# Altium schematic sheet ArduinoProMiniShematic.SchDoc
size A4
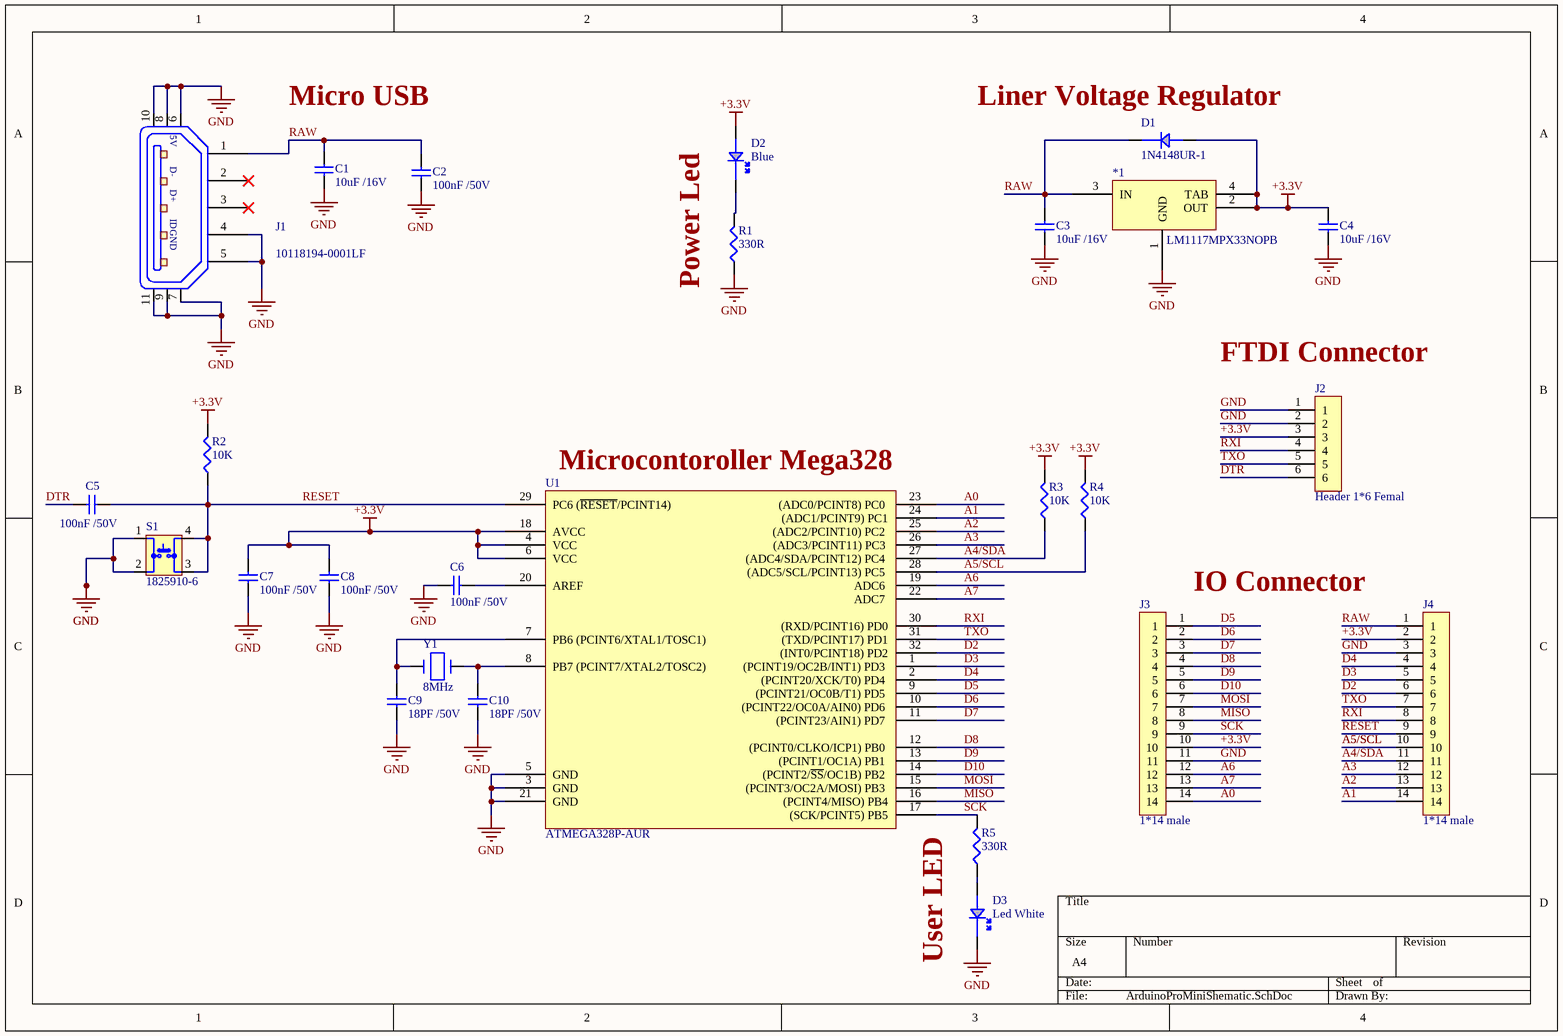
[diagram p0: ArduinoProMiniShematic.SchDoc]

## Parts
*1  LM1117MPX33NOPB  [SOT 223]
C1  10uF /16V  [C 0805]
C2  100nF /50V  [C 0805]
C3  10uF /16V  [C 0805]
C4  10uF /16V  [C 0805]
C5  100nF /50V  [C 0805]
C6  100nF /50V  [C 0805]
C7  100nF /50V  [C 0805]
C8  100nF /50V  [C 0805]
C9  18PF /50V  [C 0805]
C10  18PF /50V  [C 0805]
D1  1N4148UR-1  [DO 213AA]
D2  Blue  [LED 0603]
D3  Led White  [LED 0603]
J1  10118194-0001LF  [10118194-0001LF]
J2  Header 1*6 Femal  [Header female 1*6]
J3  1*14 male  [1*4 male header]
J4  1*14 male  [1*4 male header]
R1  330R  [R 0805]
R2  10K
R3  10K
R4  10K
R5  330R  [R 0805]
S1  1825910-6  [1825910-6]
U1  ATMEGA328P-AUR  [TQFP-32]
Y1  8MHz  [CSM-7X]

## Nets
+3.3V: *1.2(OUT) *1.4(TAB) C4.2 C7.2 C8.2 D1.1(anode) D2.1(anode) J2.3 J3.10 J4.2 R2.6 R3.6 R4.6 U1.4(VCC) U1.6(VCC) U1.18(AVCC)
GND: *1.1(GND) C1.1 C2.2 C3.1 C4.1 C6.2 C7.1 C8.1 C9.1 C10.1 D3.2(cathode) J1.4 J1.5 J1.6 J1.7 J1.8 J1.9 J1.10 J1.11 J2.1 J2.2 J3.11 J4.3 R1.5 S1.1 S1.2 U1.3(GND) U1.5(GND) U1.21(GND)
A0: J3.14 U1.23((ADC0/PCINT8)_PC0)
A1: J4.14 U1.24((ADC1/PCINT9)_PC1)
A2: J4.13 U1.25((ADC2/PCINT10)_PC2)
A3: J4.12 U1.26((ADC3/PCINT11)_PC3)
A4/SDA: J4.11 R3.5 U1.27((ADC4/SDA/PCINT12)_PC4)
A5/SCL: J4.10 R4.5 U1.28((ADC5/SCL/PCINT13)_PC5)
A6: J3.12 U1.19(ADC6)
A7: J3.13 U1.22(ADC7)
D2: J4.6 U1.32((INT0/PCINT18)_PD2)
D3: J4.5 U1.1((PCINT19/OC2B/INT1)_PD3)
D4: J4.4 U1.2((PCINT20/XCK/T0)_PD4)
D5: J3.1 U1.9((PCINT21/OC0B/T1)_PD5)
D6: J3.2 U1.10((PCINT22/OC0A/AIN0)_PD6)
D7: J3.3 U1.11((PCINT23/AIN1)_PD7)
D8: J3.4 U1.12((PCINT0/CLKO/ICP1)_PB0)
D9: J3.5 U1.13((PCINT1/OC1A)_PB1)
D10: J3.6 U1.14((PCINT2/~{SS}/OC1B)_PB2)
DTR: C5.1 J2.6
MISO: J3.8 U1.16((PCINT4/MISO)_PB4)
MOSI: J3.7 U1.15((PCINT3/OC2A/MOSI)_PB3)
RAW: *1.3(IN) C1.2 C2.1 C3.2 D1.2(cathode) J1.1 J4.1
RESET: C5.2 J4.9 R2.5 S1.3 S1.4 U1.29(PC6_(~{RESET}/PCINT14))
RXI: J2.4 J4.8 U1.30((RXD/PCINT16)_PD0)
SCK: J3.9 R5.6 U1.17((SCK/PCINT5)_PB5)
TXO: J2.5 J4.7 U1.31((TXD/PCINT17)_PD1)
NetC6_1: C6.1 U1.20(AREF)
NetC9_2: C9.2 U1.7(PB6_(PCINT6/XTAL1/TOSC1)) Y1.1
NetC10_2: C10.2 U1.8(PB7_(PCINT7/XTAL2/TOSC2)) Y1.2
NetD2_2: D2.2(cathode) R1.6
NetD3_1: D3.1(anode) R5.5

Not connected (* = marked no-connect by the designer): J1 2* 3*

## Notes on the sheet
- Micro USB
- (near D1) Liner Voltage Regulator
- Power Led
- (near J2) FTDI Connector
- (near U1) Microcontoroller Mega328
- IO Connector
- User LED
- (in symbol 10118194-0001LF) 5V; D-; D+; ID; GND

## Library data of the parts
*1 = LM1117MPX33NOPB: IC REG LIN 3.3V 800MA SOT223-4; Manufacturer 1: TI National Semiconductor; Min Input Voltage: 2.6V; Max Input Voltage: 15V; Dropout Voltage: 1.2V; Number of Outputs: 1; Output Voltage Accuracy: 1%; Output Type: Fixed; Polarity: Positive; Quiescent Current: 10mA; Supplier 1: Digi-Key; Manufacturer Part Number 1: LM1117MPX33NOPB; RoHS: Yes; Category: Voltage Regulators - Linear; Mount: Surface Mount; Case/Package: SOT-223; Number of Pins: 4; Min Operating Temperature: 0°C; Max Operating Temperature: 125°C; Packaging: Tape and Reel; Output Current: 800mA; Output Voltage: 3.3V; Max Output Current: 800mA; Nominal Output Voltage: 3.3V; Current Rating: 800mA; Accuracy: 1%; Package Quantity: 2000; Number of Regulators: 1; Min Current Limit: 800mA; Length: 6.5mm; Height: 1.6mm; Width: 3.56mm; Radiation Hardening: No; REACH SVHC: No SVHC; Lead Free: Lead Free; ComponentLink1URL: https://datasheet.ciiva.com/34302/1282978-34302146.pdf?src-supplier=Jameco; ComponentLink1Description: https://datasheet.ciiva.com/34302/1282978-34302146.pdf?src-supplier=Jameco; ComponentLink2URL: https://datasheet.ciiva.com/15111/getdatasheetpartid-97931-15111685.pdf?src-supplier=Verical; ComponentLink2Description: https://datasheet.ciiva.com/15111/getdatasheetpartid-97931-15111685.pdf?src-supplier=Verical; ComponentLink3URL: https://datasheet.ciiva.com/6596/lm1117-n-6596790.pdf?src-supplier=Digi-Key; ComponentLink3Description: https://datasheet.ciiva.com/6596/lm1117-n-6596790.pdf?src-supplier=Digi-Key; ComponentLink4URL: https://datasheet.ciiva.com/25980/lm1117-n-25980326.pdf?src-supplier=Avnet+Europe; ComponentLink4Description: https://datasheet.ciiva.com/25980/lm1117-n-25980326.pdf?src-supplier=Avnet+Europe; ComponentLink5URL: https://datasheet.ciiva.com/3223/lm1117-n-3223528.pdf?src-supplier=Avnet; ComponentLink5Description: https://datasheet.ciiva.com/3223/lm1117-n-3223528.pdf?src-supplier=Avnet; ComponentLink6URL: https://datasheet.ciiva.com/22728/lm1117-n-22728808.pdf?src-supplier=Element14; ComponentLink6Description: https://datasheet.ciiva.com/22728/lm1117-n-22728808.pdf?src-supplier=Element14; ComponentLink7URL: https://datasheet.ciiva.com/3223/lm1117-n-3223529.pdf?src-supplier=Avnet; ComponentLink7Description: https://datasheet.ciiva.com/3223/lm1117-n-3223529.pdf?src-supplier=Avnet; ComponentLink8URL: https://datasheet.ciiva.com/6596/lm1117-n-6596793.pdf?src-supplier=Digi-Key; ComponentLink8Description: https://datasheet.ciiva.com/6596/lm1117-n-6596793.pdf?src-supplier=Digi-Key; Supplier Part Number 1: LM1117MPX-3.3/NOPBTR-ND
C1 C3 C4 = C0805C106K4PACTU: KEMET - C0805C106K4PACTU - CERAMIC CAPACITOR, 10UF, 16V, X5R, 10%, 0805; Dissipation Factor: 5%; Supplier 1: Mouser; Manufacturer 1: KEMET; Manufacturer Part Number 1: C0805C106K4PACTU; RoHS: Yes; Category: Ceramic Capacitors; Stock 1: 208034; Pricing 1: 1=1.05000, 10=0.75000, 100=0.46800, 500=0.42100, 1000=0.38400, 3000=0.12900 (USD); Mount: Surface Mount; Case/Package: 0805; Number of Pins: 2; Case Code (Imperial): 0805; Case Code (Metric): 2012; Dielectric Material: Ceramic; Contact Plating: Tin,Matte; Min Operating Temperature: -55°C; Max Operating Temperature: 85°C; Voltage Rating (DC): 16V; Package Quantity: 1; Voltage Rating: 16V; Capacitance: 10uF; Tolerance: 10%; Packaging: Tape and Reel; Dielectric: X5R; Voltage: 16V; Termination: SMD/SMT; Length: 2mm; Height: 1.25mm; Width: 0.049inch; Thickness: 0.055inch; Depth: 1.25mm; Radiation Hardening: No; Lead Free: Lead Free; REACH SVHC: No SVHC; ComponentLink1URL: https://datasheet.ciiva.com/7842/1732713-7842196.pdf?src-supplier=Element14; ComponentLink1Description: https://datasheet.ciiva.com/7842/1732713-7842196.pdf?src-supplier=Element14; ComponentLink2URL: https://datasheet.ciiva.com/11787/0900766b8116eb59-11787314.pdf?src-supplier=RSComponents; ComponentLink2Description: https://datasheet.ciiva.com/11787/0900766b8116eb59-11787314.pdf?src-supplier=RSComponents; ComponentLink3URL: https://datasheet.ciiva.com/28682/1831760-28682305.pdf?src-supplier=Element14; ComponentLink3Description: https://datasheet.ciiva.com/28682/1831760-28682305.pdf?src-supplier=Element14; ComponentLink4URL: https://datasheet.ciiva.com/26847/getdatasheetpartid-110990-26847815.pdf?src-supplier=Verical; ComponentLink4Description: https://datasheet.ciiva.com/26847/getdatasheetpartid-110990-26847815.pdf?src-supplier=Verical; ComponentLink5URL: https://datasheet.ciiva.com/7842/1732713-7842197.pdf?src-supplier=Element14; ComponentLink5Description: https://datasheet.ciiva.com/7842/1732713-7842197.pdf?src-supplier=Element14; Supplier Part Number 1: 80-C0805C106K4P
C2 C5-C8 = C0805C104Z5VACTU: KEMET         C0805C104Z5VACTU.             CERAMIC CAPACITOR, 0.1UF, 50V, Y5V, +80,-20%, 0805; Tolerance: 80%; Dissipation Factor: 5%; Supplier 1: Digi-Key; Manufacturer 1: KEMET; Manufacturer Part Number 1: C0805C104Z5VACTU; RoHS: Yes; Category: Ceramic Capacitors; Stock 1: 733964; Pricing 1: 1=0.10000, 10=0.05700, 100=0.02540, 500=0.01818, 1000=0.01428 (USD); Mount: Surface Mount,PCB; Case/Package: 0805; Number of Pins: 2; Dielectric Material: Ceramic; Case Code (Metric): 2012; Case Code (Imperial): 0805; Min Operating Temperature: -30°C; Max Operating Temperature: 85°C; Termination: SMD/SMT; Voltage: 50V; Package Quantity: 1; Capacitance: 100nF; Voltage Rating: 50V; Packaging: Tape and Reel; Voltage Rating (DC): 50V; Dielectric: Y5V; Length: 2mm; Height: 0.9mm; Lead Pitch: 0.75mm; Thickness: 0.039inch; Depth: 1.25mm; Width: 0.049inch; Radiation Hardening: No; REACH SVHC: No SVHC; Lead Free: Lead Free; ComponentLink1URL: https://datasheet.ciiva.com/26847/getdatasheetpartid-321176-26847799.pdf?src-supplier=Verical; ComponentLink1Description: https://datasheet.ciiva.com/26847/getdatasheetpartid-321176-26847799.pdf?src-supplier=Verical; ComponentLink2URL: https://datasheet.ciiva.com/14608/70095383-14608251.pdf?src-supplier=Allied+Electronics; ComponentLink2Description: https://datasheet.ciiva.com/14608/70095383-14608251.pdf?src-supplier=Allied+Electronics; ComponentLink3URL: https://datasheet.ciiva.com/14597/70095383-14597846.pdf?src-supplier=Allied+Electronics; ComponentLink3Description: https://datasheet.ciiva.com/14597/70095383-14597846.pdf?src-supplier=Allied+Electronics; ComponentLink4URL: https://datasheet.ciiva.com/18219/getdatasheetpartid-37101-18219255.pdf?src-supplier=Verical; ComponentLink4Description: https://datasheet.ciiva.com/18219/getdatasheetpartid-37101-18219255.pdf?src-supplier=Verical; ComponentLink5URL: https://datasheet.ciiva.com/7842/1470417-7842543.pdf?src-supplier=Element14; ComponentLink5Description: https://datasheet.ciiva.com/7842/1470417-7842543.pdf?src-supplier=Element14; Supplier Part Number 1: 399-1177-1-ND
C9 C10 = CC0805JRNPO9BN180: Surface Mount Ceramic Multilayer Capacitor 18pF 5% C0G 50V 0805 Paper T/R; Manufacturer 1: Yageo; Insulation Resistance: 10GR; Supplier 1: Digi-Key; Manufacturer Part Number 1: CC0805JRNPO9BN180; RoHS: Yes; Category: Ceramic Capacitors; Stock 1: 38584; Pricing 1: 1=0.12000, 10=0.08700, 100=0.03870, 500=0.02764, 1000=0.02172 (USD); Mount: Surface Mount; Case/Package: 0805; Case Code (Metric): 2012; Case Code (Imperial): 0805; Material: Ceramic; Min Operating Temperature: -55°C; Max Operating Temperature: 125°C; Dielectric: C0G; Package Quantity: 4000; Capacitance: 18pF; Voltage Rating: 50V; Tolerance: 5%; Packaging: Tape and Reel; Voltage Rating (DC): 50V; Termination: SMD/SMT; Composition: Ceramic; Length: 2mm; Height: 0.6mm; Width: 0.049inch; Thickness: 0.024inch; Depth: 1.25mm; Radiation Hardening: No; Lead Free: Lead Free; ComponentLink1URL: https://datasheet.ciiva.com/26862/getdatasheetpartid-403658-26862933.pdf?src-supplier=Verical; ComponentLink1Description: https://datasheet.ciiva.com/26862/getdatasheetpartid-403658-26862933.pdf?src-supplier=Verical; ComponentLink2URL: https://datasheet.ciiva.com/144/mlccorderingcode-144754.pdf?src-supplier=Digi-Key; ComponentLink2Description: https://datasheet.ciiva.com/144/mlccorderingcode-144754.pdf?src-supplier=Digi-Key; ComponentLink3URL: https://datasheet.ciiva.com/144/mlccorderingcode-144755.pdf?src-supplier=Digi-Key; ComponentLink3Description: https://datasheet.ciiva.com/144/mlccorderingcode-144755.pdf?src-supplier=Digi-Key; ComponentLink4URL: https://datasheet.ciiva.com/144/mlccorderingcode-144756.pdf?src-supplier=Digi-Key; ComponentLink4Description: https://datasheet.ciiva.com/144/mlccorderingcode-144756.pdf?src-supplier=Digi-Key; ComponentLink5URL: https://datasheet.ciiva.com/11586/upy-gp-np0-16v-to-50v-8-11586203.pdf?src-supplier=Avnet; ComponentLink5Description: https://datasheet.ciiva.com/11586/upy-gp-np0-16v-to-50v-8-11586203.pdf?src-supplier=Avnet; ComponentLink6URL: https://datasheet.ciiva.com/29241/445366-da-01-en-kerko-chip-0805-np0-18pf-5proz50v-g-29241990.pdf?src-supplier=Conrad; ComponentLink6Description: https://datasheet.ciiva.com/29241/445366-da-01-en-kerko-chip-0805-np0-18pf-5proz50v-g-29241990.pdf?src-supplier=Conrad; Supplier Part Number 1: 311-1102-1-ND
D1 = 1N4148UR-1: Diode Switching 75V 0.2A 2-Pin DO-213AA; Manufacturer 1: Microsemi; Peak Reverse Current: 500nA; Element Configuration: Single; Average Rectified Current: 200mA; Reverse Recovery Time: 5ns; Peak Non-Repetitive Surge Current: 2A; Forward Voltage: 1.2V; Supplier 1: Digi-Key; RoHS: Yes; Category: Rectifier Diodes; Stock 1: 12442; Pricing 1: 1=1.50000, 10=1.35200, 25=1.27520, 100=0.99450, 250=0.96900, 500=0.84150, 1000=0.71400, 2500=0.70380, 5000=0.65280 (USD); Mount: Surface Mount; Number of Pins: 2; Min Operating Temperature: -65°C; Max Operating Temperature: 175°C; Max Repetitive Reverse Voltage (Vrrm): 75V; Max Reverse Voltage (DC): 75V; Forward Current: 200mA; Packaging: Bulk; Radiation Hardening: No; Lead Free: Lead Free; ComponentLink1URL: https://datasheet.ciiva.com/3304/lds-0281-1-3304223.pdf?src-supplier=Avnet; ComponentLink1Description: https://datasheet.ciiva.com/3304/lds-0281-1-3304223.pdf?src-supplier=Avnet; Supplier Part Number 1: 1N4148UR-1-ND; Manufacturer Part Number 1: 1N4148UR-1
D2 = LTST-C194TBKT: LED BLUE CLEAR SMD; Manufacturer 1: Vishay Lite-On; Lens Color: Colorless; Viewing Angle: 130°; Lens Style: Rectangular,Diffused,Colorless; Forward Current: 5mA; Forward Voltage: 3.8V; Luminous Intensity: 180mcd; Dominant Wavelength: 468nm; Test Current: 20mA; Number of Elements: 1; Power Dissipation: 76mW; Reverse Voltage: 5V; Supplier 1: Digi-Key; Manufacturer Part Number 1: LTST-C194TBKT; RoHS: Yes; Category: LEDs; Stock 1: 162242; Pricing 1: 1=0.42000, 10=0.30500, 100=0.13560, 500=0.09492, 1000=0.07797, 2500=0.06780 (USD); Mount: Surface Mount; Case/Package: 0603; Number of Pins: 2; Case Code (Metric): 1608; Color: Blue; Case Code (Imperial): 0603; Min Operating Temperature: -20°C; Max Operating Temperature: 80°C; Package Quantity: 1; Packaging: Tape and Reel; Illumination Color: Blue; Lens Transparency: Clear; Number of LEDs: 1; Length: 1.6mm; Height: 0.35mm; Width: 0.8mm; Depth: 0.8mm; Radiation Hardening: No; Lead Free: Lead Free; ComponentLink1URL: https://datasheet.ciiva.com/2115/ltst-c194tbkt-2115056.pdf?src-supplier=Digi-Key; ComponentLink1Description: https://datasheet.ciiva.com/2115/ltst-c194tbkt-2115056.pdf?src-supplier=Digi-Key; ComponentLink2URL: https://datasheet.ciiva.com/4689/lite-on-ltst-c194tbkt-187209-4689177.pdf?src-supplier=Mouser; ComponentLink2Description: https://datasheet.ciiva.com/4689/lite-on-ltst-c194tbkt-187209-4689177.pdf?src-supplier=Mouser; ComponentLink3URL: https://datasheet.ciiva.com/2115/s-110-ltst-c194tbkt-2115057.pdf?src-supplier=Digi-Key; ComponentLink3Description: https://datasheet.ciiva.com/2115/s-110-ltst-c194tbkt-2115057.pdf?src-supplier=Digi-Key
D3 = IN-S63AT5UW: Led White Clear 0603 SMD; Manufacturer 1: Inolux; Lens Style: Flat; Luminous Intensity: 900mcd; Forward Voltage: 3V; Test Current: 5mA; Viewing Angle: 120°; Lens Size: 0.8mm; Supplier 1: Digi-Key; Manufacturer Part Number 1: IN-S63AT5UW; RoHS: No; Category: LEDs; Stock 1: 14666; Pricing 1: 1=0.33000, 10=0.24000, 100=0.11360, 500=0.07576, 1000=0.05934 (USD); Mount: Surface Mount; Case/Package: 0603; Color: White; Lens Color: Clear; Case Code (Imperial): 0603; Case Code (Metric): 1608; Packaging: Tape and Reel; Lens Transparency: Clear; Length: 1.6mm; Height: 0.4mm; Width: 0.8mm; ComponentLink1URL: http://www.inolux-corp.com/datasheet/SMDLED/Mono%20Color%20Top%20View/IN-S63AT%20Series_V1.1.pdf?src-supplier=Digi-Key; ComponentLink1Description: http://www.inolux-corp.com/datasheet/SMDLED/Mono%20Color%20Top%20View/IN-S63AT%20Series_V1.1.pdf?src-supplier=Digi-Key; Supplier Part Number 1: 1830-1063-1-ND
J1 = 10118194-0001LF: CONN USB MICRO B RECPT SMT R/A; Manufacturer 1: Amphenol FCI; Connector Type: USB,Receptacle; Number of Contacts: 5; Insulation Resistance: 1GR; Number of Ports: 1; Max Voltage Rating (AC): 100V; Gender: Receptacle; Current Rating: 1.8A; Pitch: 0.65mm; Supplier 1: Digi-Key; Manufacturer Part Number 1: 10118194-0001LF; RoHS: Yes; Category: Connectors; Stock 1: 48269; Pricing 1: 1=0.43000, 10=0.40500, 25=0.36480, 50=0.32420, 100=0.31070, 250=0.28368, 500=0.27016 (USD); Mount: Surface Mount,Horizontal; Number of Terminals: 5; Contact Material: Copper Alloy; Contact Plating: Gold; Housing Material: Polymer; Color: Black; Min Operating Temperature: -55°C; Max Operating Temperature: 85°C; Termination: Solder; Orientation: Right Angle; Features: Shielded; Package Quantity: 9600; Packaging: Tape and Reel; Length: 8.05mm; Depth: 5mm; Radiation Hardening: No; Lead Free: Lead Free; Flammability Rating: UL94 V-0; ComponentLink1URL: https://datasheet.ciiva.com/4598/10118194ac-197217-4598807.pdf?src-supplier=Mouser; ComponentLink1Description: https://datasheet.ciiva.com/4598/10118194ac-197217-4598807.pdf?src-supplier=Mouser; ComponentLink2URL: https://datasheet.ciiva.com/26945/getdatasheetpartid-418619-26945695.pdf?src-supplier=Verical; ComponentLink2Description: https://datasheet.ciiva.com/26945/getdatasheetpartid-418619-26945695.pdf?src-supplier=Verical; ComponentLink3URL: https://datasheet.ciiva.com/851/10118194-851111.pdf?src-supplier=Digi-Key; ComponentLink3Description: https://datasheet.ciiva.com/851/10118194-851111.pdf?src-supplier=Digi-Key; ComponentLink4URL: https://datasheet.ciiva.com/851/10118194-851110.pdf?src-supplier=Digi-Key; ComponentLink4Description: https://datasheet.ciiva.com/851/10118194-851110.pdf?src-supplier=Digi-Key; Supplier Part Number 1: 609-4618-1-ND
J2 = M20-7820646: 06-WAY SIL VERT SOCKET L/FREE; Manufacturer 1: Harwin; Number of Positions: 6; Gender: Female; Connector Type: Receptacle,Socket; Max Current Rating: 3A; Contact Resistance: 20mR; Pitch: 2.54mm; Supplier 1: Digi-Key; Manufacturer Part Number 1: M20-7820646; RoHS: Yes; Category: Headers and Wire Housings; Stock 1: 1353; Pricing 1: 1=0.96000, 10=0.84200, 100=0.72600, 500=0.59400, 1000=0.52800, 5000=0.46200, 10000=0.43890 (USD); Mount: Through Hole; Case/Package: SIL; Housing Material: Nylon; Color: Black; Contact Plating: Tin; Contact Material: Bronze; Housing Color: Black; Min Operating Temperature: -40°C; Max Operating Temperature: 105°C; Termination: Solder; Packaging: Rail/Tube; Number of Rows: 1; Package Quantity: 38; Number of Contacts: 6; Orientation: Straight; Contact Gender: Female; Length: 15.64mm; Depth: 2.5mm; Radiation Hardening: No; ComponentLink1URL: http://components.arrow.com/part/dataview/0323_00725884?src-supplier=Arrow+Europe; ComponentLink1Description: http://components.arrow.com/part/dataview/0323_00725884?src-supplier=Arrow+Europe; ComponentLink2URL: http://www.harwin.com/include/downloads/pdfs/2010PAGE120.PDF?src-supplier=Avnet; ComponentLink2Description: http://www.harwin.com/include/downloads/pdfs/2010PAGE120.PDF?src-supplier=Avnet; ComponentLink3URL: https://cdn.harwin.com/pdfs/M20-782.pdf?src-supplier=Digi-Key; ComponentLink3Description: https://cdn.harwin.com/pdfs/M20-782.pdf?src-supplier=Digi-Key; ComponentLink4URL: https://cdn.harwin.com/pdfs/Harwin_PC_Connectors_M20.pdf?src-supplier=Avnet+Europe; ComponentLink4Description: https://cdn.harwin.com/pdfs/Harwin_PC_Connectors_M20.pdf?src-supplier=Avnet+Europe; ComponentLink5URL: https://cdn.harwin.com/pdfs/Harwin_PC_Connectors_M20.pdf?src-supplier=RSComponents; ComponentLink5Description: https://cdn.harwin.com/pdfs/Harwin_PC_Connectors_M20.pdf?src-supplier=RSComponents; ComponentLink6URL: https://cdn.harwin.com/pdfs/Harwin_PC_Connectors_M20.pdf?src-supplier=Mouser; ComponentLink6Description: https://cdn.harwin.com/pdfs/Harwin_PC_Connectors_M20.pdf?src-supplier=Mouser; ComponentLink7URL: https://cdn.harwin.com/pdfs/Harwin_PC_Connectors_M20.pdf?src-supplier=TTI; ComponentLink7Description: https://cdn.harwin.com/pdfs/Harwin_PC_Connectors_M20.pdf?src-supplier=TTI; Supplier Part Number 1: 952-1809-ND
J3 J4 = PH1-14-UA: 14 Position Single Row Straight Gold Flash Header; Manufacturer 1: Adam Equipment; Supplier 1: Digi-Key; Manufacturer Part Number 1: PH1-14-UA; RoHS: Yes; Pricing 1: 1=0.21000, 10=0.20100, 100=0.13940, 500=0.11798, 1000=0.09653, 5000=0.08581, 10000=0.07776 (USD); Lead Free: Lead Free; ComponentLink1URL: https://datasheet.ciiva.com/16480/catpg250-254-16480235.pdf?src-supplier=Future+Electronics; ComponentLink1Description: https://datasheet.ciiva.com/16480/catpg250-254-16480235.pdf?src-supplier=Future+Electronics; Supplier Part Number 1: 2057-PH1-14-UA-ND
R1 R5 = RC0805JR-07330RL: YAGEO   RC0805JR-07330RL   THICK FILM RESISTOR, 330 OHM, 125mW, 5%, FULL REEL; Voltage Rating: 150V; Temperature Coefficient: 100ppm/°C; Supplier 1: Digi-Key; Manufacturer 1: Yageo; Manufacturer Part Number 1: RC0805JR-07330RL; RoHS: Yes; Category: Chip SMD Resistors; Stock 1: 1770872; Pricing 1: 1=0.10000, 10=0.03500, 100=0.01400, 1000=0.00631, 2500=0.00548 (USD); Case/Package: 0805; Contact Plating: Tin,Matte,Lead; Case Code (Imperial): 0805; Case Code (Metric): 2012; Min Operating Temperature: -55°C; Max Operating Temperature: 155°C; Package Quantity: 5000; Tolerance: 5%; Resistance: 330R; Power Rating: 125mW; Packaging: Tape and Reel; Termination: SMD/SMT; Composition: Thick Film; Military Standard: Not; Length: 2mm; Height: 0.5mm; Width: 1.25mm; Depth: 1.25mm; Radiation Hardening: No; Lead Free: Lead Free; REACH SVHC: No SVHC; ComponentLink1URL: https://datasheet.ciiva.com/17008/rc0805-17008395.pdf?src-supplier=Future+Electronics; ComponentLink1Description: https://datasheet.ciiva.com/17008/rc0805-17008395.pdf?src-supplier=Future+Electronics; ComponentLink2URL: https://datasheet.ciiva.com/46395/444164-46395119.pdf?src-supplier=Element14; ComponentLink2Description: https://datasheet.ciiva.com/46395/444164-46395119.pdf?src-supplier=Element14; ComponentLink3URL: https://datasheet.ciiva.com/7941/442941-7941941.pdf?src-supplier=Element14; ComponentLink3Description: https://datasheet.ciiva.com/7941/442941-7941941.pdf?src-supplier=Element14; ComponentLink4URL: https://datasheet.ciiva.com/7941/442941-7941942.pdf?src-supplier=Element14; ComponentLink4Description: https://datasheet.ciiva.com/7941/442941-7941942.pdf?src-supplier=Element14; ComponentLink5URL: https://datasheet.ciiva.com/12555/rc0805-257173-12555078.pdf?src-supplier=Mouser; ComponentLink5Description: https://datasheet.ciiva.com/12555/rc0805-257173-12555078.pdf?src-supplier=Mouser; Supplier Part Number 1: 311-330ARCT-ND
R2-R4 = RC0805FR-0710KL: RES SMD 10K OHM 1% 1/8W 0805; Manufacturer 1: Yageo; Temperature Coefficient: 100ppm/°C; Resistance: 10kR; Power Rating: 125mW; Voltage Rating: 150V; Supplier 1: Digi-Key; Manufacturer Part Number 1: RC0805FR-0710KL; RoHS: Yes; Category: Chip SMD Resistors; Stock 1: 23160439; Pricing 1: 1=0.10000, 10=0.04000, 100=0.01630, 1000=0.00731, 2500=0.00635 (USD); Case/Package: 0805; Case Code (Imperial): 0805; Case Code (Metric): 2012; Min Operating Temperature: -55°C; Max Operating Temperature: 155°C; Composition: Thick Film; Tolerance: 1%; Packaging: Tape and Reel; Features: Moisture Resistant; Termination: SMD/SMT; Number of Terminations: 2; Military Standard: Not; Max Power Dissipation: 125mW; Package Quantity: 1; Length: 2mm; Height: 0.024inch; Width: 0.049inch; Depth: 1.25mm; Lead Free: Lead Free; REACH SVHC: Unknown; ComponentLink1URL: https://datasheet.ciiva.com/11808/0900766b8106beab-11808151.pdf?src-supplier=RSComponents; ComponentLink1Description: https://datasheet.ciiva.com/11808/0900766b8106beab-11808151.pdf?src-supplier=RSComponents; ComponentLink2URL: https://datasheet.ciiva.com/12669/rc0805-12669688.pdf?src-supplier=Mouser; ComponentLink2Description: https://datasheet.ciiva.com/12669/rc0805-12669688.pdf?src-supplier=Mouser; ComponentLink3URL: https://datasheet.ciiva.com/2456/pyu-r-int-thick-7-2456973.pdf?src-supplier=Digi-Key; ComponentLink3Description: https://datasheet.ciiva.com/2456/pyu-r-int-thick-7-2456973.pdf?src-supplier=Digi-Key; ComponentLink4URL: https://datasheet.ciiva.com/16747/rc0805-16747087.pdf?src-supplier=Future+Electronics; ComponentLink4Description: https://datasheet.ciiva.com/16747/rc0805-16747087.pdf?src-supplier=Future+Electronics; ComponentLink5URL: https://datasheet.ciiva.com/46447/444164-46447563.pdf?src-supplier=Element14; ComponentLink5Description: https://datasheet.ciiva.com/46447/444164-46447563.pdf?src-supplier=Element14; ComponentLink6URL: https://datasheet.ciiva.com/2456/pyu-r-int-thick-7-2456972.pdf?src-supplier=Digi-Key; ComponentLink6Description: https://datasheet.ciiva.com/2456/pyu-r-int-thick-7-2456972.pdf?src-supplier=Digi-Key; ComponentLink7URL: https://datasheet.ciiva.com/2456/pyu-r-int-thick-7-2456974.pdf?src-supplier=Digi-Key; ComponentLink7Description: https://datasheet.ciiva.com/2456/pyu-r-int-thick-7-2456974.pdf?src-supplier=Digi-Key; Supplier Part Number 1: 311-10.0KCRCT-ND
S1 = 1825910-6: SWITCH TACTILE SPST-NO 0.05A 24V; Manufacturer 1: TE Connectivity Alcoswitch; Mechanical Life: 100000Cycles; Actuator Material: PBT; Max Current Rating: 50mA; Operating Force: 160gf; Contact Resistance: 100mR; Switch Function: Off-Mom; Actuator Type: Standard; Illumination Type: Non-Illuminated,Illuminated; Switch Travel: 0.25mm; Throw Configuration: SPST; Actuator Length: 0.055inch; Supplier 1: Digi-Key; Manufacturer Part Number 1: 1825910-6; RoHS: Yes; Category: Pushbutton Switches; Stock 1: 18203; Pricing 1: 1=0.10000, 10=0.10100, 25=0.09560, 100=0.08700, 250=0.08180, 500=0.07484, 1000=0.06265, 2500=0.06092, 5000=0.05743 (USD); Mount: Through Hole; Contact Material: Copper Alloy; Contact Plating: Silver; Min Operating Temperature: -35°C; Max Operating Temperature: 85°C; Package Quantity: 750; Packaging: Loose Piece; Max Voltage Rating (DC): 24V; Type: Switch; Contact Current Rating: 50mA; Orientation: Straight; Termination: PC Pins; Electrical Life: 100000Cycles; Length: 5.99mm; Lead Free: Lead Free; ELV: Compliant; REACH SVHC: Unknown; ComponentLink1URL: https://datasheet.ciiva.com/30199/1825910-6rqpn1825910-6-30199520.pdf?src-supplier=Onlinecomponents.com; ComponentLink1Description: https://datasheet.ciiva.com/30199/1825910-6rqpn1825910-6-30199520.pdf?src-supplier=Onlinecomponents.com; ComponentLink2URL: https://datasheet.ciiva.com/15184/getdatasheetpartid-395915-15184509.pdf?src-supplier=Verical; ComponentLink2Description: https://datasheet.ciiva.com/15184/getdatasheetpartid-395915-15184509.pdf?src-supplier=Verical
U1 = ATMEGA328P-AUR: ATMEL         ATMEGA328P-AUR             8 Bit Microcontroller, Low Power High Performance, ATmega, 20 MHz, 32 KB, 2 KB, 32 Pins, TQFP; Manufacturer 1: Microchip / Atmel; Memory Type: FLASH; Memory Size: 32KB; Core Architecture: AVR; Peripherals: Brown-out Detect/Reset,POR,PWM,WDT; Watchdog Timer: Yes; Min Supply Voltage: 1.8V; Max Frequency: 20MHz; Max Supply Voltage: 5.5V; Interface: I2C,SPI,UART,USART; RAM Size: 2KB; Number of I/Os: 23; Number of Timers/Counters: 3; Oscillator Type: Internal; Data Bus Width: 8b; Supplier 1: Digi-Key; Manufacturer Part Number 1: ATMEGA328P-AUR; RoHS: Yes; Category: Microcontrollers; Stock 1: 20409; Pricing 1: 1=2.08000, 25=1.91000, 100=1.73000 (USD); Mount: Surface Mount; Case/Package: A; Number of Pins: 32; Contact Plating: Tin,Matte; Min Operating Temperature: -40°C; Max Operating Temperature: 85°C; Packaging: Tape and Reel; Frequency: 20MHz; Package Quantity: 2000; Number of Programmable I/O: 23; REACH SVHC: No SVHC; Lead Free: Lead Free; ComponentLink1URL: https://datasheet.ciiva.com/6641/atmega48a-pa-88a-pa-168a-pa-328-p-ds-ds40002061a-6641009.pdf?src-supplier=Digi-Key; ComponentLink1Description: https://datasheet.ciiva.com/6641/atmega48a-pa-88a-pa-168a-pa-328-p-ds-ds40002061a-6641009.pdf?src-supplier=Digi-Key; Supplier Part Number 1: ATMEGA328P-AURCT-ND
Y1 = ECS-80-18-5PX-TR: Crystal 8MHz ±30ppm (Tol) ±50ppm (Stability) 18pF FUND 60Ohm 2-Pin HC-49/USX SMD T/R; Manufacturer 1: ECS International; ESR (Equivalent Series Resistance): 60R; Supplier 1: Digi-Key; Manufacturer Part Number 1: ECS-80-18-5PX-TR; RoHS: Yes; Category: Crystals; Stock 1: 31114; Pricing 1: 1=0.50000, 10=0.41300, 50=0.37120, 100=0.33000, 500=0.31350 (USD); Mount: Surface Mount; Min Operating Temperature: -10°C; Max Operating Temperature: 70°C; Frequency Stability: 50ppm; Termination: SMD/SMT; Package Quantity: 1000; Frequency: 8MHz; Load Capacitance: 18pF; Packaging: Tape and Reel; Tolerance: 30ppm; Frequency Tolerance: 30ppm; Length: 0.449inch; Height: 0.169inch; Width: 4.8mm; Lead Free: Lead Free; ComponentLink1URL: https://datasheet.ciiva.com/852/csm-7x-852380.pdf?src-supplier=Digi-Key; ComponentLink1Description: https://datasheet.ciiva.com/852/csm-7x-852380.pdf?src-supplier=Digi-Key; ComponentLink2URL: https://datasheet.ciiva.com/852/csm-7x-852381.pdf?src-supplier=Digi-Key; ComponentLink2Description: https://datasheet.ciiva.com/852/csm-7x-852381.pdf?src-supplier=Digi-Key; ComponentLink3URL: https://datasheet.ciiva.com/852/csm-7x-852382.pdf?src-supplier=Digi-Key; ComponentLink3Description: https://datasheet.ciiva.com/852/csm-7x-852382.pdf?src-supplier=Digi-Key